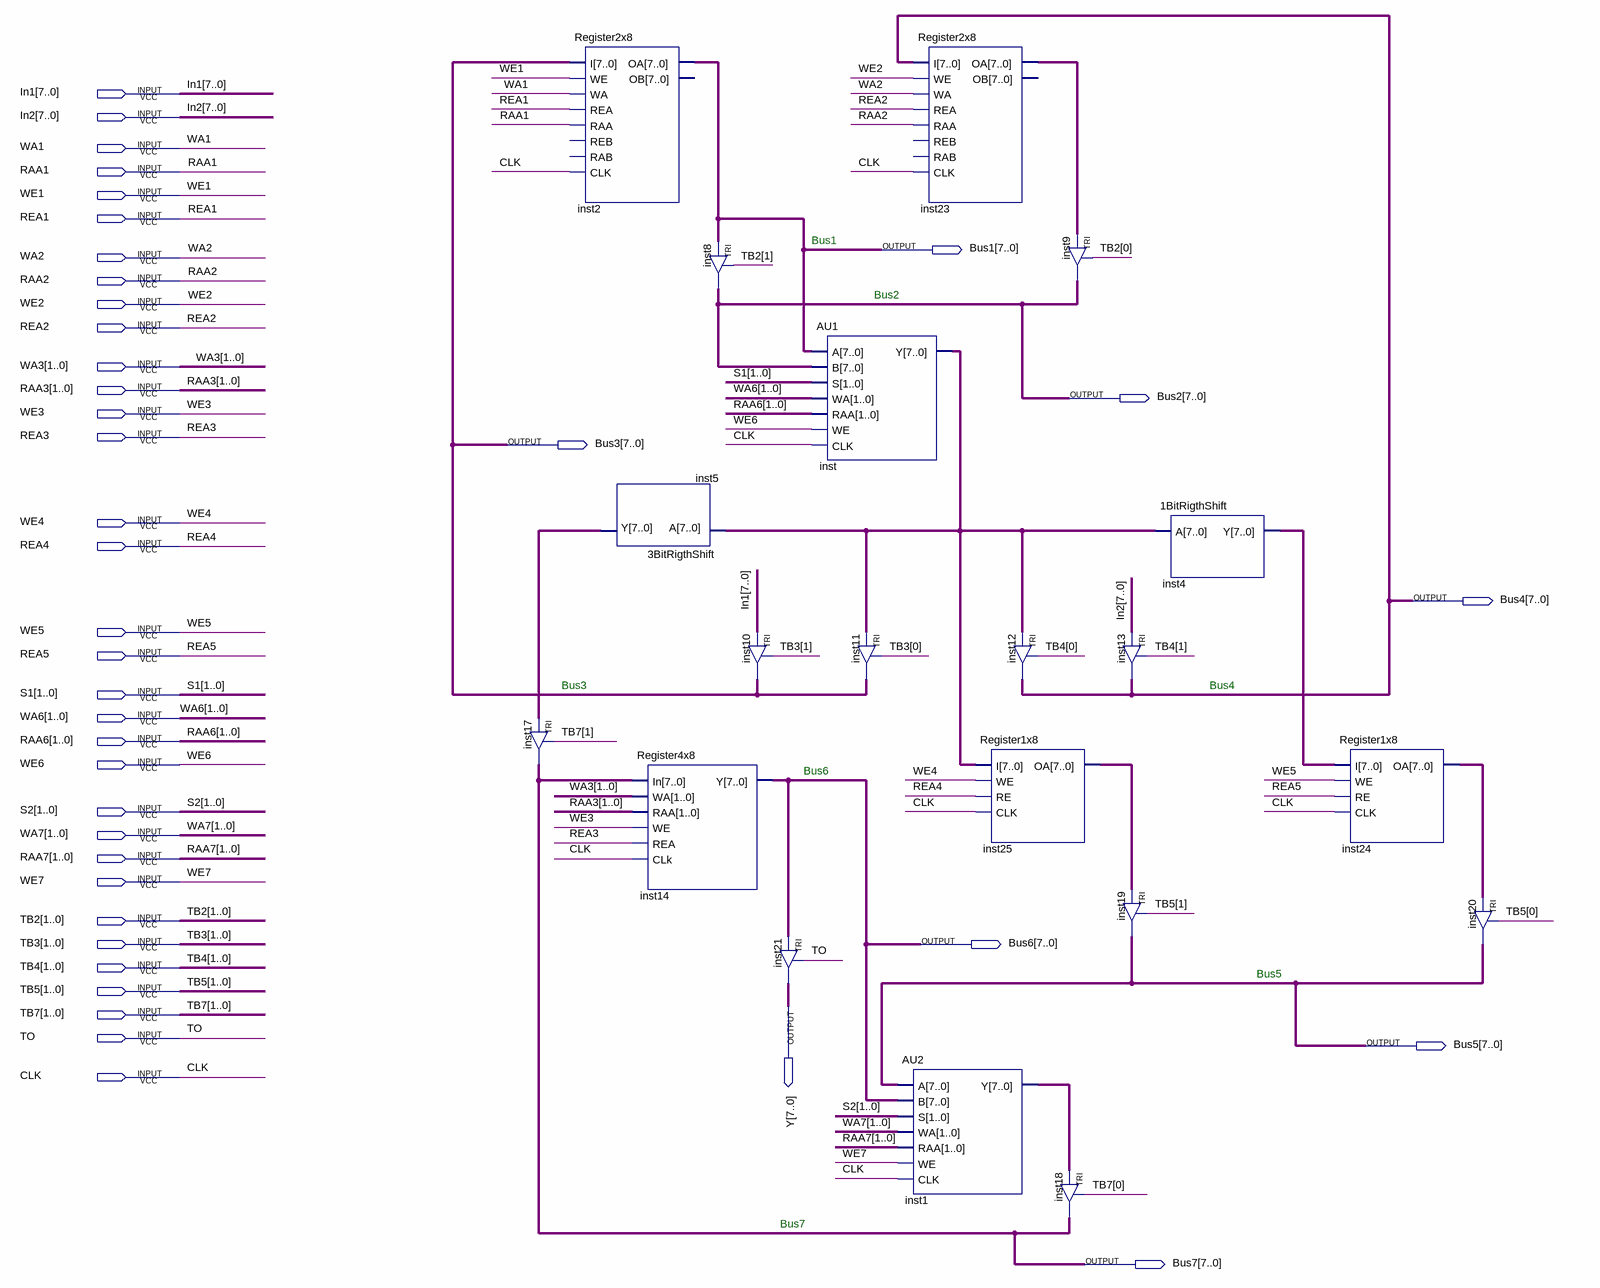
[diagram p0: schematic sheet]
// Quartus schematic Datapath.bdf as structural Verilog: 20 symbols, 41 pins
module Datapath (
  input  [7:0] In1,
  input  [7:0] In2,
  input  WA1,
  input  RAA1,
  input  WE1,
  input  REA1,
  input  WA2,
  input  RAA2,
  input  WE2,
  input  REA2,
  input  [1:0] WA3,
  input  [1:0] RAA3,
  input  WE3,
  input  REA3,
  input  WE4,
  input  REA4,
  input  WE5,
  input  REA5,
  input  [1:0] S1,
  input  [1:0] WA6,
  input  [1:0] RAA6,
  input  WE6,
  input  [1:0] S2,
  input  [1:0] WA7,
  input  [1:0] RAA7,
  input  WE7,
  input  [1:0] TB2,
  input  [1:0] TB3,
  input  [1:0] TB4,
  input  [1:0] TB5,
  input  [1:0] TB7,
  input  TO,
  input  CLK,
  output [7:0] Bus1,
  output [7:0] Bus2,
  output [7:0] Bus3,
  output [7:0] Bus4,
  output [7:0] Bus6,
  output [7:0] Y,
  output [7:0] Bus5,
  output [7:0] Bus7
);

  wire [7:0] inst1_y, inst4_y, inst5_y, inst23_oa, inst24_oa, inst25_oa, inst_y;

  TRI inst17[7:0] (.IN(inst5_y), .OE(TB7[1]), .OUT(Bus7));
  Register2x8 inst2 (.I(Bus3), .WE(WE1), .WA(WA1), .REA(REA1), .RAA(RAA1), .CLK(CLK), .OA(Bus1));  // open: REB, RAB, OB
  \3BitRigthShift  inst5 (.A(inst_y), .Y(inst5_y));
  Register4x8 inst14 (.In(Bus7), .WA(WA3), .RAA(RAA3), .WE(WE3), .REA(REA3), .CLk(CLK), .Y(Bus6));
  TRI inst8[7:0] (.IN(Bus1), .OE(TB2[1]), .OUT(Bus2));
  TRI inst10[7:0] (.IN(In1), .OE(TB3[1]), .OUT(Bus3));
  AU1 inst (.A(Bus1), .B(Bus2), .S(S1), .WA(WA6), .RAA(RAA6), .WE(WE6), .CLK(CLK), .Y(inst_y));
  TRI inst21[7:0] (.IN(Bus6), .OE(TO), .OUT(Y));
  TRI inst11[7:0] (.IN(inst_y), .OE(TB3[0]), .OUT(Bus3));
  Register2x8 inst23 (
    .I(Bus4), .WE(WE2), .WA(WA2), .REA(REA2), .RAA(RAA2), .CLK(CLK), .OA(inst23_oa));  // open: REB, RAB, OB
  AU2 inst1 (.A(Bus5), .B(Bus6), .S(S2), .WA(WA7), .RAA(RAA7), .WE(WE7), .CLK(CLK), .Y(inst1_y));
  Register1x8 inst25 (.I(inst_y), .WE(WE4), .RE(REA4), .CLK(CLK), .OA(inst25_oa));
  TRI inst9[7:0] (.IN(inst23_oa), .OE(TB2[0]), .OUT(Bus2));
  TRI inst12[7:0] (.IN(inst_y), .OE(TB4[0]), .OUT(Bus4));
  TRI inst18[7:0] (.IN(inst1_y), .OE(TB7[0]), .OUT(Bus7));
  TRI inst13[7:0] (.IN(In2), .OE(TB4[1]), .OUT(Bus4));
  TRI inst19[7:0] (.IN(inst25_oa), .OE(TB5[1]), .OUT(Bus5));
  \1BitRigthShift  inst4 (.A(inst_y), .Y(inst4_y));
  Register1x8 inst24 (.I(inst4_y), .WE(WE5), .RE(REA5), .CLK(CLK), .OA(inst24_oa));
  TRI inst20[7:0] (.IN(inst24_oa), .OE(TB5[0]), .OUT(Bus5));

  // Notes on the sheet:
  //   Bus1
  //   Bus2
  //   Bus3
  //   Bus4
  //   Bus6
  //   Bus5
  //   Bus7
endmodule
